# Altium schematic sheet 16.RK3568_VI Interface.SchDoc
size 594 x 420 mm
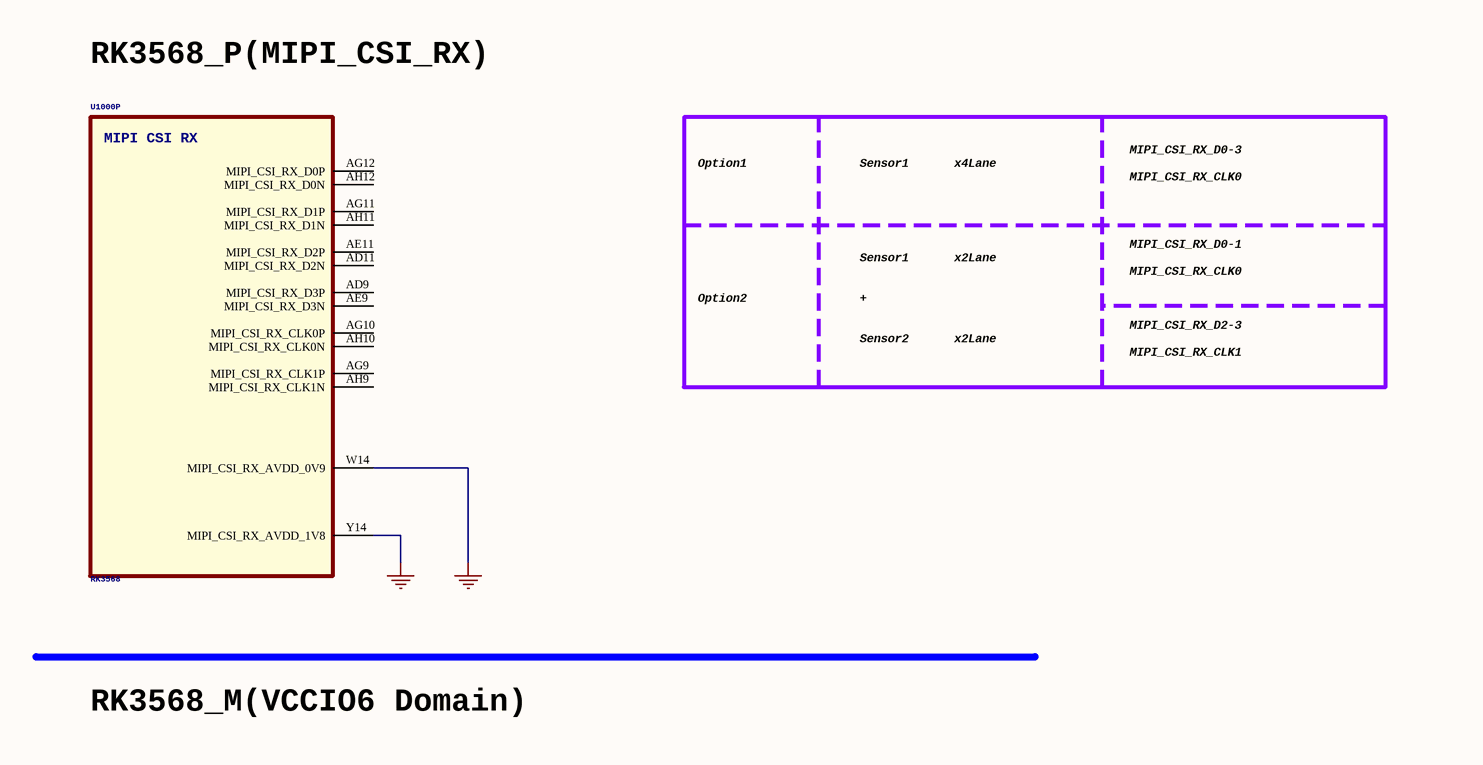
[diagram p0: 16.RK3568_VI Interface.SchDoc, top left]
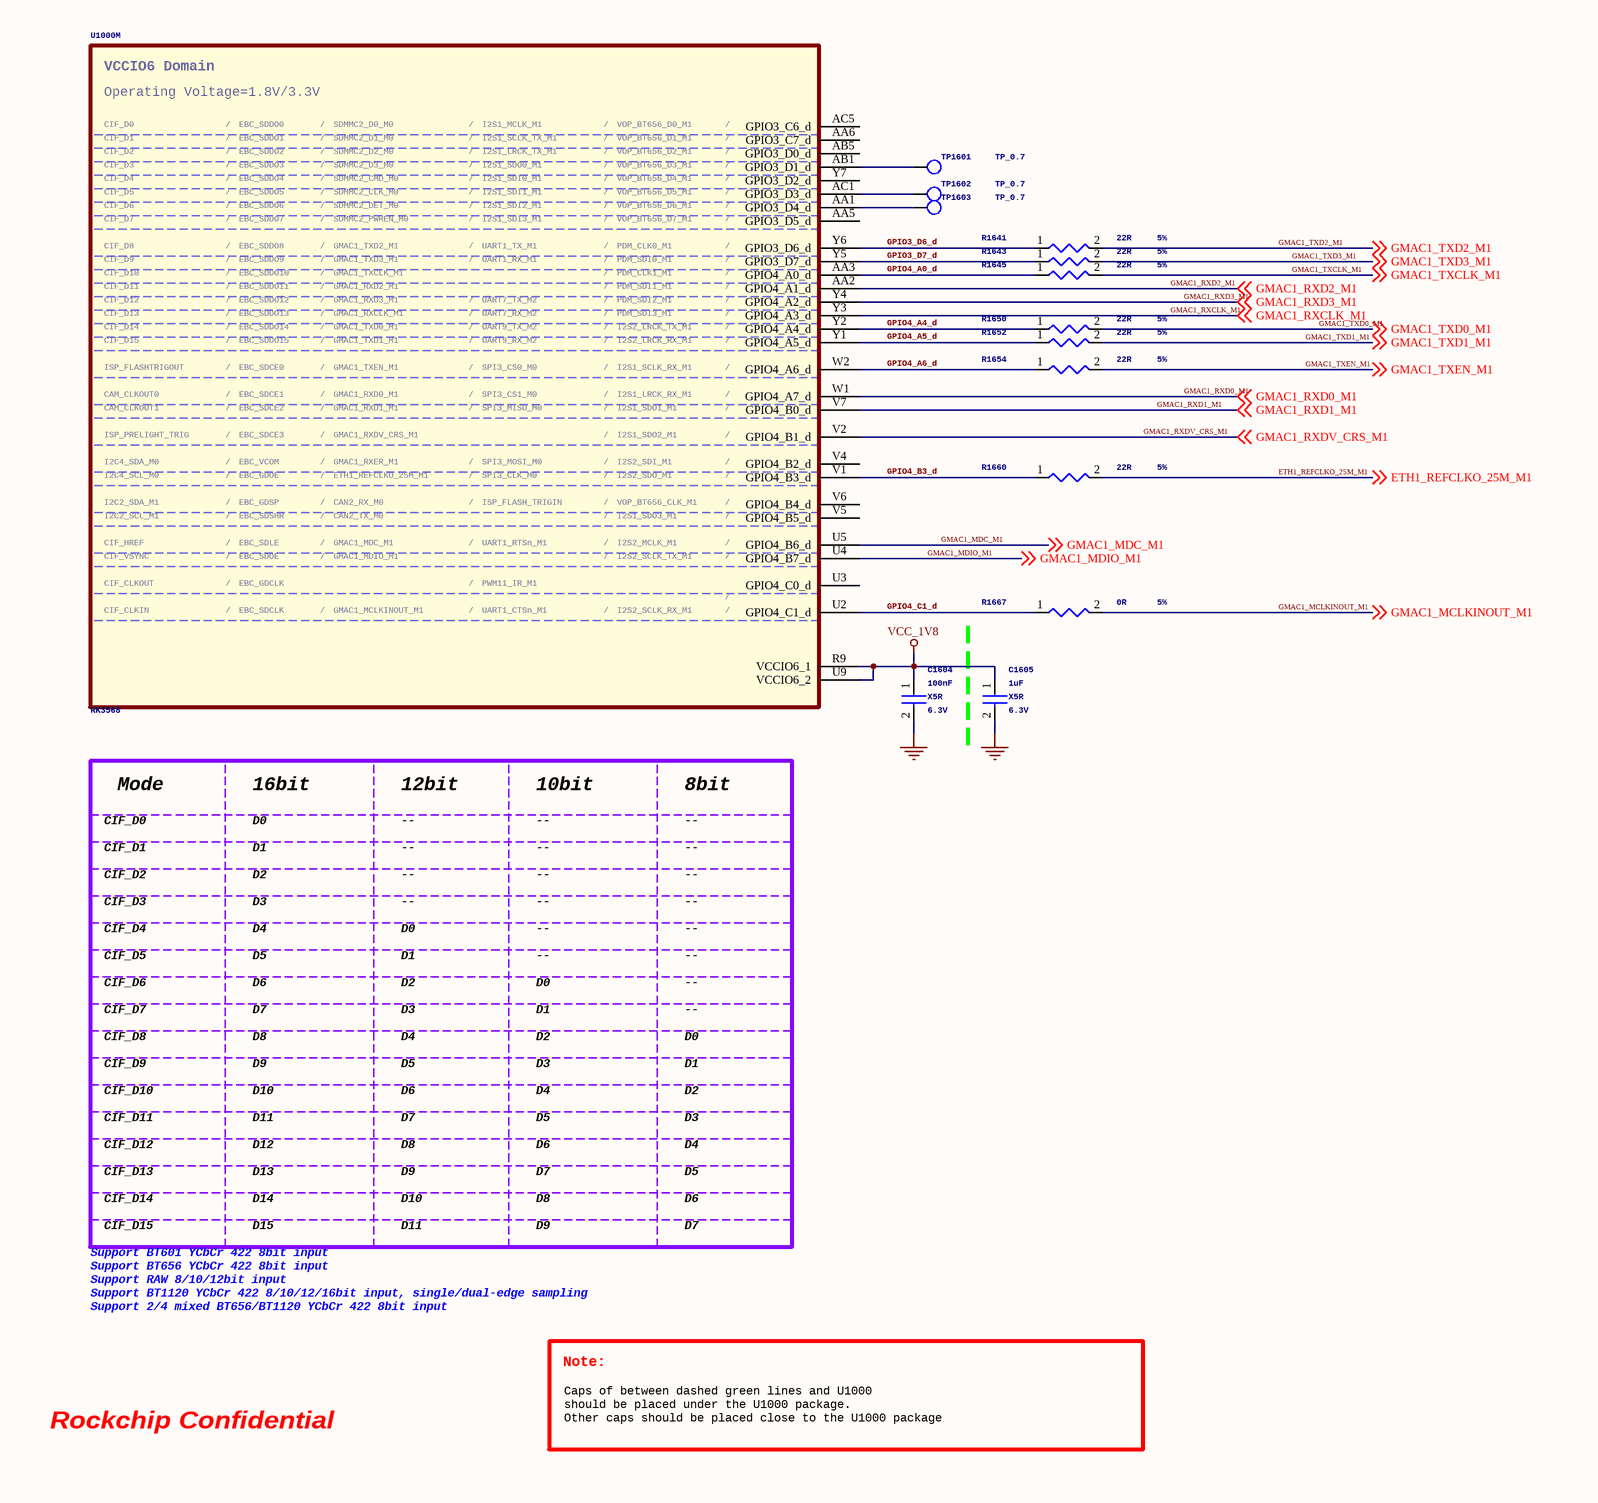
[diagram p1: 16.RK3568_VI Interface.SchDoc, bottom left]
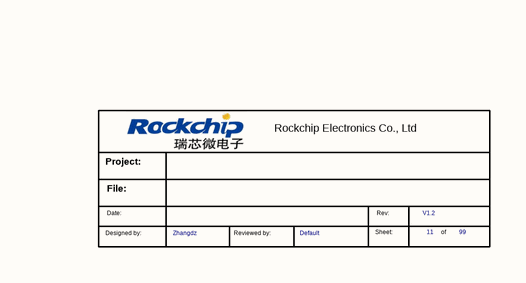
[diagram p2: 16.RK3568_VI Interface.SchDoc, bottom right]

## Parts
*  Schematic Page Count: 99  Schematic Page Number: 11  Designer: Zhangdz  Revision: V1.2  Check: Default  (hidden comment: Rockchip_new)  (graphical)
C1604  100nF  Voltage: 6.3V  Dielectric: X5R  [C0201]
C1605  1uF  Voltage: 6.3V  Dielectric: X5R  [C0402]
R1641  22R  Tolerance: 5%  [R0402]
R1643  22R  Tolerance: 5%  [R0402]
R1645  22R  Tolerance: 5%  [R0402]
R1650  22R  Tolerance: 5%  [R0402]
R1652  22R  Tolerance: 5%  [R0402]
R1654  22R  Tolerance: 5%  [R0402]
R1660  22R  Tolerance: 5%  [R0402]
R1667  0R  Tolerance: 5%  [R0402]
TP1601  TP_0.7  [TP_0R70]
TP1602  TP_0.7  [TP_0R70]
TP1603  TP_0.7  [TP_0R70]
U1000  RK3568  [BGA636_19R00X19R00X1R20]  (parts M,P of 23)

## Nets
GND: C1604.2 C1605.2 U1000.W14(MIPI_CSI_RX_AVDD_0V9) U1000.Y14(MIPI_CSI_RX_AVDD_1V8)
VCC_1V8: C1604.1 C1605.1 U1000.R9(VCCIO6_1) U1000.U9(VCCIO6_2)
ETH1_REFCLKO_25M_M1: R1660.2 ; off-sheet ETH1_REFCLKO_25M_M1
GMAC1_MCLKINOUT_M1: R1667.2 ; off-sheet GMAC1_MCLKINOUT_M1
GMAC1_MDC_M1: U1000.U5(GPIO4_B6_d) ; off-sheet GMAC1_MDC_M1
GMAC1_MDIO_M1: U1000.U4(GPIO4_B7_d) ; off-sheet GMAC1_MDIO_M1
GMAC1_RXCLK_M1: U1000.Y3(GPIO4_A3_d) ; off-sheet GMAC1_RXCLK_M1
GMAC1_RXD0_M1: U1000.W1(GPIO4_A7_d) ; off-sheet GMAC1_RXD0_M1
GMAC1_RXD1_M1: U1000.V7(GPIO4_B0_d) ; off-sheet GMAC1_RXD1_M1
GMAC1_RXD2_M1: U1000.AA2(GPIO4_A1_d) ; off-sheet GMAC1_RXD2_M1
GMAC1_RXD3_M1: U1000.Y4(GPIO4_A2_d) ; off-sheet GMAC1_RXD3_M1
GMAC1_RXDV_CRS_M1: U1000.V2(GPIO4_B1_d) ; off-sheet GMAC1_RXDV_CRS_M1
GMAC1_TXCLK_M1: R1645.2 ; off-sheet GMAC1_TXCLK_M1
GMAC1_TXD0_M1: R1650.2 ; off-sheet GMAC1_TXD0_M1
GMAC1_TXD1_M1: R1652.2 ; off-sheet GMAC1_TXD1_M1
GMAC1_TXD2_M1: R1641.2 ; off-sheet GMAC1_TXD2_M1
GMAC1_TXD3_M1: R1643.2 ; off-sheet GMAC1_TXD3_M1
GMAC1_TXEN_M1: R1654.2 ; off-sheet GMAC1_TXEN_M1
GPIO3_D6_d: R1641.1 U1000.Y6(GPIO3_D6_d)
GPIO3_D7_d: R1643.1 U1000.Y5(GPIO3_D7_d)
GPIO4_A0_d: R1645.1 U1000.AA3(GPIO4_A0_d)
GPIO4_A4_d: R1650.1 U1000.Y2(GPIO4_A4_d)
GPIO4_A5_d: R1652.1 U1000.Y1(GPIO4_A5_d)
GPIO4_A6_d: R1654.1 U1000.W2(GPIO4_A6_d)
GPIO4_B3_d: R1660.1 U1000.V1(GPIO4_B3_d)
GPIO4_C1_d: R1667.1 U1000.U2(GPIO4_C1_d)
NetTP1601_1: TP1601.1 U1000.AB1(GPIO3_D1_d)
NetTP1602_1: TP1602.1 U1000.AC1(GPIO3_D3_d)
NetTP1603_1: TP1603.1 U1000.AA1(GPIO3_D4_d)

Not connected (* = marked no-connect by the designer): U1000 AA5(GPIO3_D5_d) AA6(GPIO3_C7_d) AB5(GPIO3_D0_d) AC5(GPIO3_C6_d) AD9(MIPI_CSI_RX_D3P) AD11(MIPI_CSI_RX_D2N) AE9(MIPI_CSI_RX_D3N) AE11(MIPI_CSI_RX_D2P) AG9(MIPI_CSI_RX_CLK1P) AG10(MIPI_CSI_RX_CLK0P) AG11(MIPI_CSI_RX_D1P) AG12(MIPI_CSI_RX_D0P) AH9(MIPI_CSI_RX_CLK1N) AH10(MIPI_CSI_RX_CLK0N) AH11(MIPI_CSI_RX_D1N) AH12(MIPI_CSI_RX_D0N) U3(GPIO4_C0_d) V4(GPIO4_B2_d) V5(GPIO4_B5_d) V6(GPIO4_B4_d) Y7(GPIO3_D2_d)

## Notes on the sheet
- RK3568_P(MIPI_CSI_RX)
- Option1
- Sensor1
- x4Lane
- MIPI_CSI_RX_D0-3
- MIPI_CSI_RX_CLK0
- x2Lane
- MIPI_CSI_RX_D0-1
- Option2
- +
- Sensor2
- MIPI_CSI_RX_D2-3
- MIPI_CSI_RX_CLK1
- RK3568_M(VCCIO6 Domain)
- CIF_D0
- Mode
- 16bit
- D0
- 12bit
- --
- 10bit
- 8bit
- CIF_D1
- CIF_D2
- D1
- D2
- CIF_D3
- CIF_D4
- CIF_D5
- D3
- D4
- D5
- CIF_D6
- CIF_D7
- D6
- D7
- CIF_D8
- CIF_D9
- CIF_D10
- D8
- D9
- D10
- CIF_D11
- CIF_D12
- D11
- D12
- CIF_D13
- CIF_D14
- CIF_D15
- D13
- D14
- D15
- Support BT601 YCbCr 422 8bit input
- Support BT656 YCbCr 422 8bit input
- Support BT1120 YCbCr 422 8/10/12/16bit input, single/dual-edge sampling
- Support RAW 8/10/12bit input
- Support 2/4 mixed BT656/BT1120 YCbCr 422 8bit input
- Note:
- Rockchip Confidential
- Caps of between dashed green lines and U1000
  should be placed under the U1000 package.
  Other caps should be placed close to the U1000 package
- (in symbol Rockchip_new) Rockchip Electronics Co., Ltd; Project:; File:; Date:; Rev:; Designed by:; Reviewed by:; Sheet:; of
- (in symbol SOC_RK3568, part M) VCCIO6 Domain; Operating Voltage=1.8V/3.3V; CIF_D0; /; EBC_SDDO0; SDMMC2_D0_M0; I2S1_MCLK_M1; VOP_BT656_D0_M1; CIF_D1; EBC_SDDO1; SDMMC2_D1_M0; I2S1_SCLK_TX_M1; VOP_BT656_D1_M1; CIF_D2; EBC_SDDO2; SDMMC2_D2_M0; I2S1_LRCK_TX_M1; VOP_BT656_D2_M1; CIF_D3; EBC_SDDO3; SDMMC2_D3_M0; I2S1_SDO0_M1; VOP_BT656_D3_M1; CIF_D4; EBC_SDDO4; SDMMC2_CMD_M0; I2S1_SDI0_M1; VOP_BT656_D4_M1; CIF_D5; EBC_SDDO5; SDMMC2_CLK_M0; I2S1_SDI1_M1; VOP_BT656_D5_M1; CIF_D6; EBC_SDDO6; SDMMC2_DET_M0; I2S1_SDI2_M1; VOP_BT656_D6_M1; CIF_D7; EBC_SDDO7; SDMMC2_PWREN_M0; I2S1_SDI3_M1; VOP_BT656_D7_M1; CIF_D8; EBC_SDDO8; GMAC1_TXD2_M1; UART1_TX_M1; PDM_CLK0_M1; CIF_D9; EBC_SDDO9; GMAC1_TXD3_M1; UART1_RX_M1; PDM_SDI0_M1; CIF_D10; EBC_SDDO10; GMAC1_TXCLK_M1; PDM_CLK1_M1; CIF_D11; EBC_SDDO11; GMAC1_RXD2_M1; PDM_SDI1_M1; CIF_D12; EBC_SDDO12; GMAC1_RXD3_M1; UART7_TX_M2; PDM_SDI2_M1; CIF_D13; EBC_SDDO13; GMAC1_RXCLK_M1; UART7_RX_M2; PDM_SDI3_M1; CIF_D14; EBC_SDDO14; GMAC1_TXD0_M1; UART9_TX_M2; I2S2_LRCK_TX_M1; CIF_D15; EBC_SDDO15; GMAC1_TXD1_M1; UART9_RX_M2; I2S2_LRCK_RX_M1; ISP_FLASHTRIGOUT; EBC_SDCE0; GMAC1_TXEN_M1; SPI3_CS0_M0; I2S1_SCLK_RX_M1; CAM_CLKOUT0; EBC_SDCE1; GMAC1_RXD0_M1; SPI3_CS1_M0; I2S1_LRCK_RX_M1; CAM_CLKOUT1; EBC_SDCE2; GMAC1_RXD1_M1; SPI3_MISO_M0; I2S1_SDO1_M1; ISP_PRELIGHT_TRIG; EBC_SDCE3; GMAC1_RXDV_CRS_M1; I2S1_SDO2_M1; I2C4_SDA_M0; EBC_VCOM; GMAC1_RXER_M1; SPI3_MOSI_M0; I2S2_SDI_M1; I2C4_SCL_M0; EBC_GDOE; ETH1_REFCLKO_25M_M1; SPI3_CLK_M0; I2S2_SDO_M1; I2C2_SDA_M1; EBC_GDSP; CAN2_RX_M0; ISP_FLASH_TRIGIN; VOP_BT656_CLK_M1; I2C2_SCL_M1; EBC_SDSHR; CAN2_TX_M0; I2S1_SDO3_M1; CIF_HREF; EBC_SDLE; GMAC1_MDC_M1; UART1_RTSn_M1; I2S2_MCLK_M1; CIF_VSYNC; EBC_SDOE; GMAC1_MDIO_M1; I2S2_SCLK_TX_M1; CIF_CLKOUT; EBC_GDCLK; PWM11_IR_M1; CIF_CLKIN; EBC_SDCLK; GMAC1_MCLKINOUT_M1; UART1_CTSn_M1; I2S2_SCLK_RX_M1
- (in symbol SOC_RK3568, part P) MIPI CSI RX

## Library data of the parts
* = Rockchip_new: Page Count: 37; Page Number: 13; Revcode: V1.2
C1604 = CAP NP: cap,100.00nF,+/-10%,6.3V,X5R,C0201; Manufacturer: TDK; RK PN: C0603X5R0J104K030BC; Priority: A; Tolerance: 10%; Part Type: C0201; Manufacturer PN: C0603X5R0J104K030BC; Created by: JJJ
C1605 = CAP NP: cap,1.00uF,+/-10%,6.3V,X5R,C0402; Manufacturer: TDK; RK PN: C1005X5R0J105K050BB; Priority: A; Tolerance: 10%; Part Type: C0402; Manufacturer PN: C1005X5R0J105K050BB; Created by: JJJ
R1641 R1643 R1645 R1650 R1660 = RESISTOR: 通用厚膜电阻,22R,+/-5%,R0402,1/16W.; Manufacturer PN: RC0402JR-0722RL; Manufacturer: YAGEO; Wattage: 1/16W; Priority: A; Created by: YTL; Part Type: 通用厚膜电阻; RK PN: RC0402JR-0722RL
R1652 R1654 = RESISTOR: 通用厚膜电阻,22R,+/-5%,R0402,1/16W.; Manufacturer: YAGEO; RK PN: RC0402JR-0722RL; Priority: A; Wattage: 1/16W; Part Type: 通用厚膜电阻; Manufacturer PN: RC0402JR-0722RL; Created by: YTL
R1667 = RESISTOR: 通用厚膜电阻,0R,+/-5%,R0402,1/16W.; Manufacturer PN: RC0402JR-070RL; Manufacturer: YAGEO; Wattage: 1/16W; Priority: A; Created by: YTL; Part Type: 通用厚膜电阻; RK PN: RC0402JR-070RL
TP1601-TP1603 = TP: Test Point 0.7mm; RK PN: TESTPOINT_0R7; Priority: A; Part Type: TP; Created by: JJJ
U1000 = SOC_RK3568: ROCKCHIP SOC; Manufacturer: Rockchip (瑞芯微); SPLIT_INST: TRUE; SWAP_INFO: (S1+S2+S3+S4+S5+S6+S7+S8+S9+S10+S11+S12+S13+S14+S15+S16+S17+S18+S19+S20+S21+S22+S23); Priority: A; RK PN: RK3568; Part Type: SOC; Manufacturer PN: RK3568; Created by: JJJ